# Altium schematic sheet TIDA-010933-DCDC-ControlCard.SchDoc
size 431 x 279 mm; Date: Not shown in title block; ApprovedBy: Not shown in title block; CheckedBy: Not shown in title block; Author: Not shown in title block; CompanyName: Not shown in title block; Engineer: Not shown in title block; Organization: Not shown in title block; Address1: Not shown in title block; Address2: Not shown in title block; Address3: Not shown in title block; Address4: Not shown in title block; DocumentNumber: 2; Revision: Use project parameter SCH_Rev; SheetNumber: 7; SheetTotal: 11; PageSetup: Record=PageOptions|CenterHorizontal=True|CenterVertical=True|PrintScale=1.00|XCorrection=1.00|YCorrection=1.00|PrintKind=0|BorderSize=5000000|LeftOffset=0|BottomOffset=0|Orientation=2|PaperLength=1000|PaperWidth=1000|Scale=100|PaperSource=15|PrintQuality=600|MediaType=1|DitherType=10|PaperKind=Letter|PrintScaleMode=1; CurrentTime: Not shown in title block; CurrentDate: Not shown in title block; Time: Not shown in title block; DocumentFullPathAndName: Not shown in title block; DocumentName: Not shown in title block; ModifiedDate: 1/25/2022; ImagePath: Not shown in title block
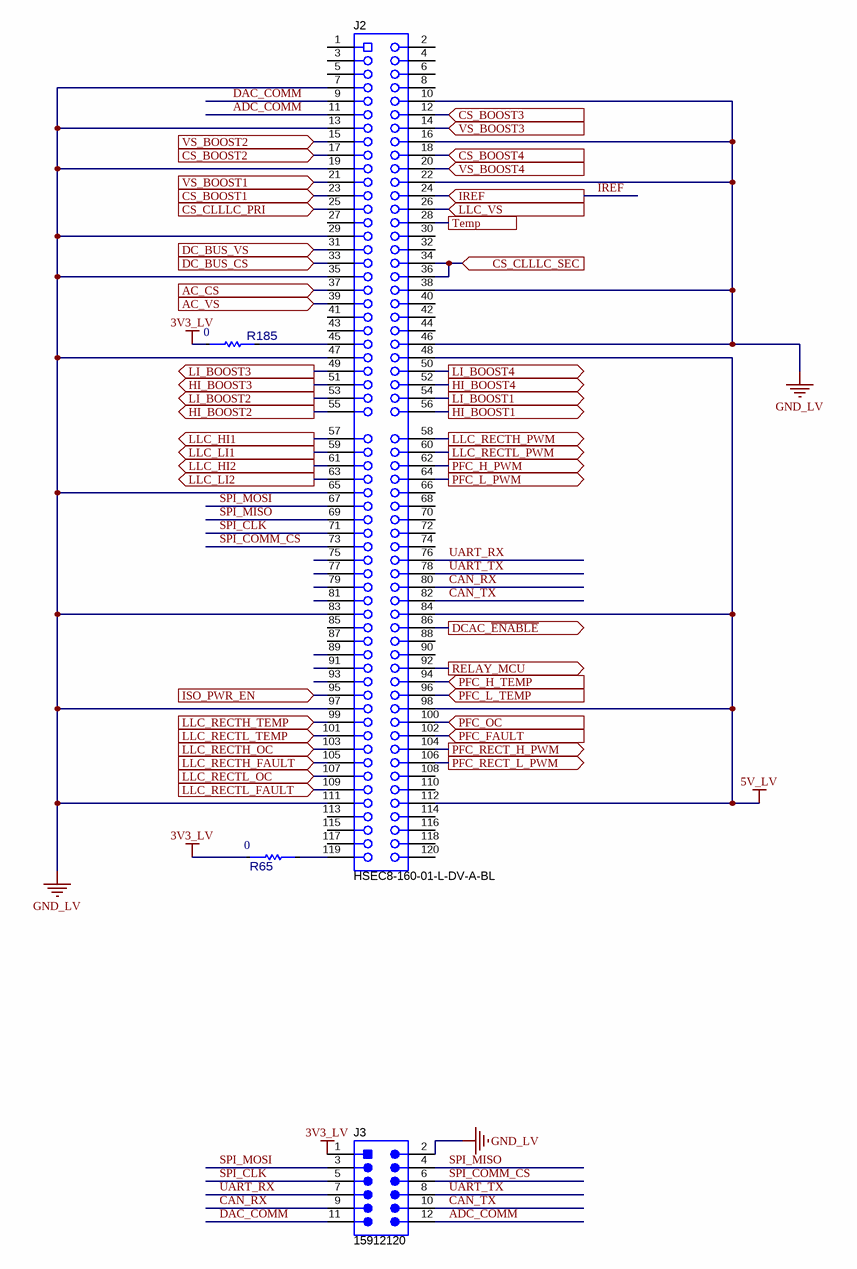
[diagram p0: TIDA-010933-DCDC-ControlCard.SchDoc]

## Parts
J2  HSEC8-160-01-L-DV-A-BL  [controlCARD-120HSEC]
J3  15912120  [MOLEX_0015912120]
R65  value 0  [FP-RC0402JR-070RP_0402-MFG]  (hidden comment: RC0402JR-070RP)
R185  value 0  [FP-RC0402JR-070RP_0402-MFG]  (hidden comment: RC0402JR-070RP)

## Ports
AC_CS (in), AC_VS (in), CS_BOOST1 (in), CS_BOOST2 (in), CS_BOOST3 (in), CS_BOOST4 (in), CS_CLLLC_PRI (in), CS_CLLLC_SEC (in), DC_BUS_CS (in), DC_BUS_VS (in), DCAC_~{ENABLE} (out), HI_BOOST1 (out), HI_BOOST2 (out), HI_BOOST3 (out), HI_BOOST4 (out), IREF (in), ISO_PWR_EN (in), LI_BOOST1 (out), LI_BOOST2 (out), LI_BOOST3 (out), LI_BOOST4 (out), LLC_HI1 (out), LLC_HI2 (out), LLC_LI1 (out), LLC_LI2 (out), LLC_RECTH_FAULT (in), LLC_RECTH_OC (in), LLC_RECTH_PWM (out), LLC_RECTH_TEMP (in), LLC_RECTL_FAULT (in), LLC_RECTL_OC (in), LLC_RECTL_PWM (out), LLC_RECTL_TEMP (in), LLC_VS (in), PFC_FAULT (in), PFC_H_PWM (out), PFC_H_TEMP (in), PFC_L_PWM (out), PFC_L_TEMP (in), PFC_OC (in), PFC_RECT_H_PWM (out), PFC_RECT_L_PWM (out), RELAY_MCU (out), Temp, VS_BOOST1 (in), VS_BOOST2 (in), VS_BOOST3 (in), VS_BOOST4 (in)

## Nets
3V3_LV: J3.1 R65.1 R185.1
5V_LV: J2.48 J2.84 J2.98 J2.112
GND_LV: J2.7 J2.10 J2.13 J2.16 J2.19 J2.22 J2.29 J2.35 J2.38 J2.46 J2.47 J2.65 J2.83 J2.97 J2.111 J3.2
AC_CS: J2.37 ; port AC_CS
AC_VS: J2.39 ; port AC_VS
ADC_COMM: J2.11 J3.12
CAN_RX: J2.80 J3.9
CAN_TX: J2.82 J3.10
CS_BOOST1: J2.23 ; port CS_BOOST1
CS_BOOST2: J2.17 ; port CS_BOOST2
CS_BOOST3: J2.12 ; port CS_BOOST3
CS_BOOST4: J2.18 ; port CS_BOOST4
CS_CLLLC_PRI: J2.25 ; port CS_CLLLC_PRI
CS_CLLLC_SEC: J2.34 J2.36 ; port CS_CLLLC_SEC
DAC_COMM: J2.9 J3.11
DC_BUS_CS: J2.33 ; port DC_BUS_CS
DC_BUS_VS: J2.31 ; port DC_BUS_VS
DCAC_~{ENABLE}: J2.86 ; port DCAC_~{ENABLE}
HI_BOOST1: J2.56 ; port HI_BOOST1
HI_BOOST2: J2.55 ; port HI_BOOST2
HI_BOOST3: J2.51 ; port HI_BOOST3
HI_BOOST4: J2.52 ; port HI_BOOST4
IREF: J2.24 ; port IREF
ISO_PWR_EN: J2.95 ; port ISO_PWR_EN
LI_BOOST1: J2.54 ; port LI_BOOST1
LI_BOOST2: J2.53 ; port LI_BOOST2
LI_BOOST3: J2.49 ; port LI_BOOST3
LI_BOOST4: J2.50 ; port LI_BOOST4
LLC_HI1: J2.57 ; port LLC_HI1
LLC_HI2: J2.61 ; port LLC_HI2
LLC_LI1: J2.59 ; port LLC_LI1
LLC_LI2: J2.63 ; port LLC_LI2
LLC_RECTH_FAULT: J2.105 ; port LLC_RECTH_FAULT
LLC_RECTH_OC: J2.103 ; port LLC_RECTH_OC
LLC_RECTH_PWM: J2.58 ; port LLC_RECTH_PWM
LLC_RECTH_TEMP: J2.99 ; port LLC_RECTH_TEMP
LLC_RECTL_FAULT: J2.109 ; port LLC_RECTL_FAULT
LLC_RECTL_OC: J2.107 ; port LLC_RECTL_OC
LLC_RECTL_PWM: J2.60 ; port LLC_RECTL_PWM
LLC_RECTL_TEMP: J2.101 ; port LLC_RECTL_TEMP
LLC_VS: J2.26 ; port LLC_VS
PFC_FAULT: J2.102 ; port PFC_FAULT
PFC_H_PWM: J2.62 ; port PFC_H_PWM
PFC_H_TEMP: J2.94 ; port PFC_H_TEMP
PFC_L_PWM: J2.64 ; port PFC_L_PWM
PFC_L_TEMP: J2.96 ; port PFC_L_TEMP
PFC_OC: J2.100 ; port PFC_OC
PFC_RECT_H_PWM: J2.104 ; port PFC_RECT_H_PWM
PFC_RECT_L_PWM: J2.106 ; port PFC_RECT_L_PWM
RELAY_MCU: J2.92 ; port RELAY_MCU
SPI_CLK: J2.71 J3.5
SPI_COMM_CS: J2.73 J3.6
SPI_MISO: J2.69 J3.4
SPI_MOSI: J2.67 J3.3
Temp: J2.28 ; port Temp
UART_RX: J2.76 J3.7
UART_TX: J2.78 J3.8
VS_BOOST1: J2.21 ; port VS_BOOST1
VS_BOOST2: J2.15 ; port VS_BOOST2
VS_BOOST3: J2.14 ; port VS_BOOST3
VS_BOOST4: J2.20 ; port VS_BOOST4
NetJ2_45: J2.45 R185.2
NetJ2_119: J2.119 R65.2

Not connected (* = marked no-connect by the designer): J2 1 2 3 4 5 6 8 27 30 32 40 41 42 43 44 66 68 70 72 74 75 77 79 81 85 87 88 89 90 91 93 108 110 113 114 115 116 117 118 120

## Notes on the sheet
- Drawn By:
- SVN Rev:
- Number:
- TID #:
- Orderable:
- Rev:
- Sheet Title:
- File:
- Project Title:
- Designed for:
- Assembly Variant:
- Mod. Date:
- Sheet:
- Size:
- of
- B
- http://www.ti.com
- Texas Instruments and/or its licensors do not warrant the accuracy or completeness of this specification or any information contained therein. Texas Instruments and/or its licensors do not warrant that this design will meet the specifications, will be suitable for your application or fit for any particular purpose, or will operate in an implementation. Texas Instruments and/or its licensors do not warrant that the design is production worthy. You should completely validate and test your design implementation to confirm the system functionality for your application.
- Engineer:
- Contact:
- © Texas Instruments

## Library data of the parts
J2 = CMP-0003814-2: C2000 controlCARD-120HSEC connector, SMT; Manufacturer: Samtec; Note: The pin numbering does not match Samtec datasheet; ComponentLink1URL: http://www.samtec.com/ftppub/pdf/hsec8_dv.pdf; CompType: Connector; PackageReference: C2000 pin numbering; RoHS: Y; MountType: SMT; PartNumber: HSEC8-160-01-L-DV-A-BL; ComponentLink1Description: Datasheet Link
J3 = CMP-0055315-2: Header, 100mil, 6x2, SMT; Manufacturer: Molex; Green_Lifecycle: Active; Green_REACh: Passed; ComponentLink1URL: http://www.molex.com/pdm_docs/sd/015912120_sd.pdf; ClassName: Header; RoHS: Y; MountType: SMT; Green_EU RoHS-2: Passed; Supplier 1: Digi-Key; Green_EU RoHS: Passed; PackageReference: Header, 6x2, SMT; CompType: Header; PartNumber: 15912120; ComponentLink1Description: Datasheet URL; Supplier Part Number 1: WM17452-ND
R65 R185 = CMP-0093147-1: Res Jumper Thick Film 0402 0 Ohm 5% 1/16W Molded SMD Paper T/R; Manufacturer: Yageo; AEC Qualified: No; Power_W: 63mW; SizeZ_mm: 0.4mm; VDC_V: 50V; ComponentLink1URL: https://www.yageo.com/upload/media/product/productsearch/datasheet/rchip/PYu-RC_51_RoHS_P_2.pdf; RoHS: TRUE; Mouser Part Number: 603-RC0402JR-070RP; helpURL: https://upverter.com/upn/revision/1e1ee5977c47aafb/; Supplier Part Number 2: 603-RC0402JR-070RP; Res_ohm: 0; Supplier Part Number 1: YAG1279CT-ND; Technology: Thick Film; Datasheet Path: datasheets/Res-RC0402JR-070RP.pdf; Lead Free: Yes; Part Number: RC0402JR-070RP; ComponentLink1Description: Datasheet; Supplier 1: Digikey; PartNumber: RC0402JR-070RP; Mouser Description: RC Series 0402 Jumper Thick Film Chip Resistor; Operating Temperature Range: -55°C to +155°C; datasheet: https://www.yageo.com/upload/media/product/productsearch/datasheet/rchip/PYu-RC_51_RoHS_P_2.pdf; PackageReference: 0402; Digikey Part Number: YAG1279CT-ND; Digikey Description: RES SMD 0 OHM JUMPER 1/16W 0402; Series: RC_P; Supplier 2: Mouser